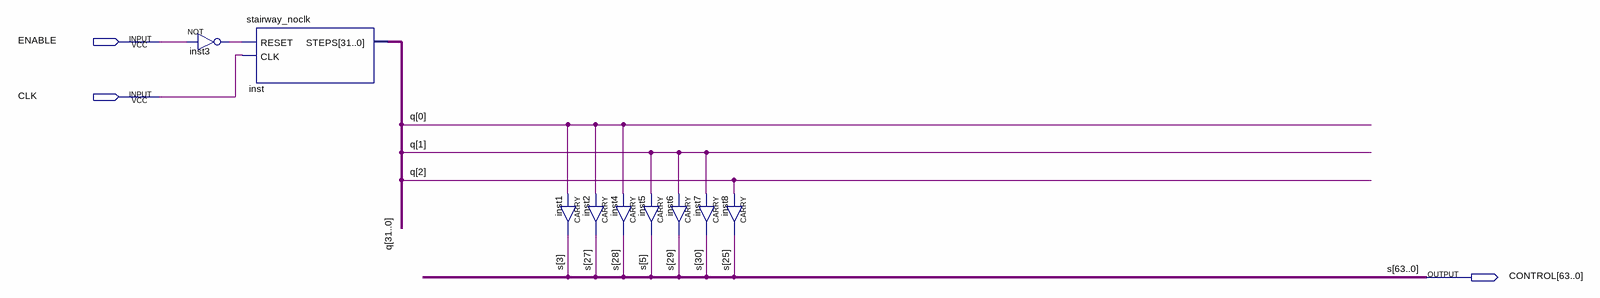
[diagram p0: schematic sheet]
// Quartus schematic macro_direct_true.bdf as structural Verilog: 9 symbols, 3 pins
module macro_direct_true (
  input  ENABLE,
  input  CLK,
  output [63:0] CONTROL
);

  wire inst3_out;
  wire [31:0] q;

  not inst3 (inst3_out, ENABLE);
  stairway_noclk inst (.RESET(inst3_out), .CLK(CLK), .STEPS(q));
  CARRY inst1 (.IN(q[0]), .OUT(CONTROL[3]));
  CARRY inst2 (.IN(q[0]), .OUT(CONTROL[27]));
  CARRY inst4 (.IN(q[0]), .OUT(CONTROL[28]));
  CARRY inst5 (.IN(q[1]), .OUT(CONTROL[5]));
  CARRY inst6 (.IN(q[1]), .OUT(CONTROL[29]));
  CARRY inst7 (.IN(q[1]), .OUT(CONTROL[30]));
  CARRY inst8 (.IN(q[2]), .OUT(CONTROL[25]));

  // Other names for the same wires on the sheet: s[63:0] = CONTROL
endmodule
